# EAGLE schematic DIYFanSpansion v1 (EAGLE 7.2.0)
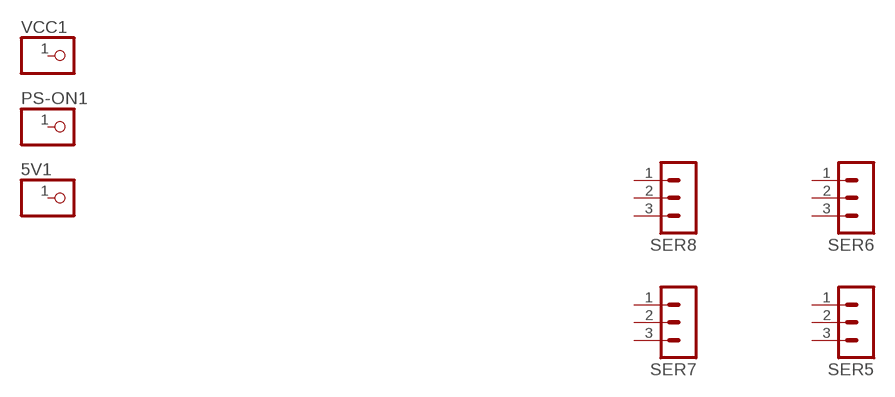
[diagram p0: schematic, sheet 1]

## Parts
5V1  PINHD-1X1  [1X01]
PS-ON1  PINHD-1X1  [1X01]
SER5  3PIN-HEADER  [3PIN-HEADER]
SER6  3PIN-HEADER  [3PIN-HEADER]
SER7  3PIN-HEADER  [3PIN-HEADER]
SER8  3PIN-HEADER  [3PIN-HEADER]
VCC1  PINHD-1X1  [1X01]
Unconnected: 5V1.1 PS-ON1.1 SER5.1 SER5.2 SER5.3 SER6.1 SER6.2 SER6.3 SER7.1 SER7.2 SER7.3 SER8.1 SER8.2 SER8.3 VCC1.1

## Library data of the parts
5V1 PS-ON1 VCC1 = adafruit:PINHD-1X1: Pin header 1x1 for 0.1" spacing With round pins
SER5-SER8 = ultimachine:3PIN-HEADER: PIN HEADER